# EAGLE design pc-bus (EAGLE 9.6.2)
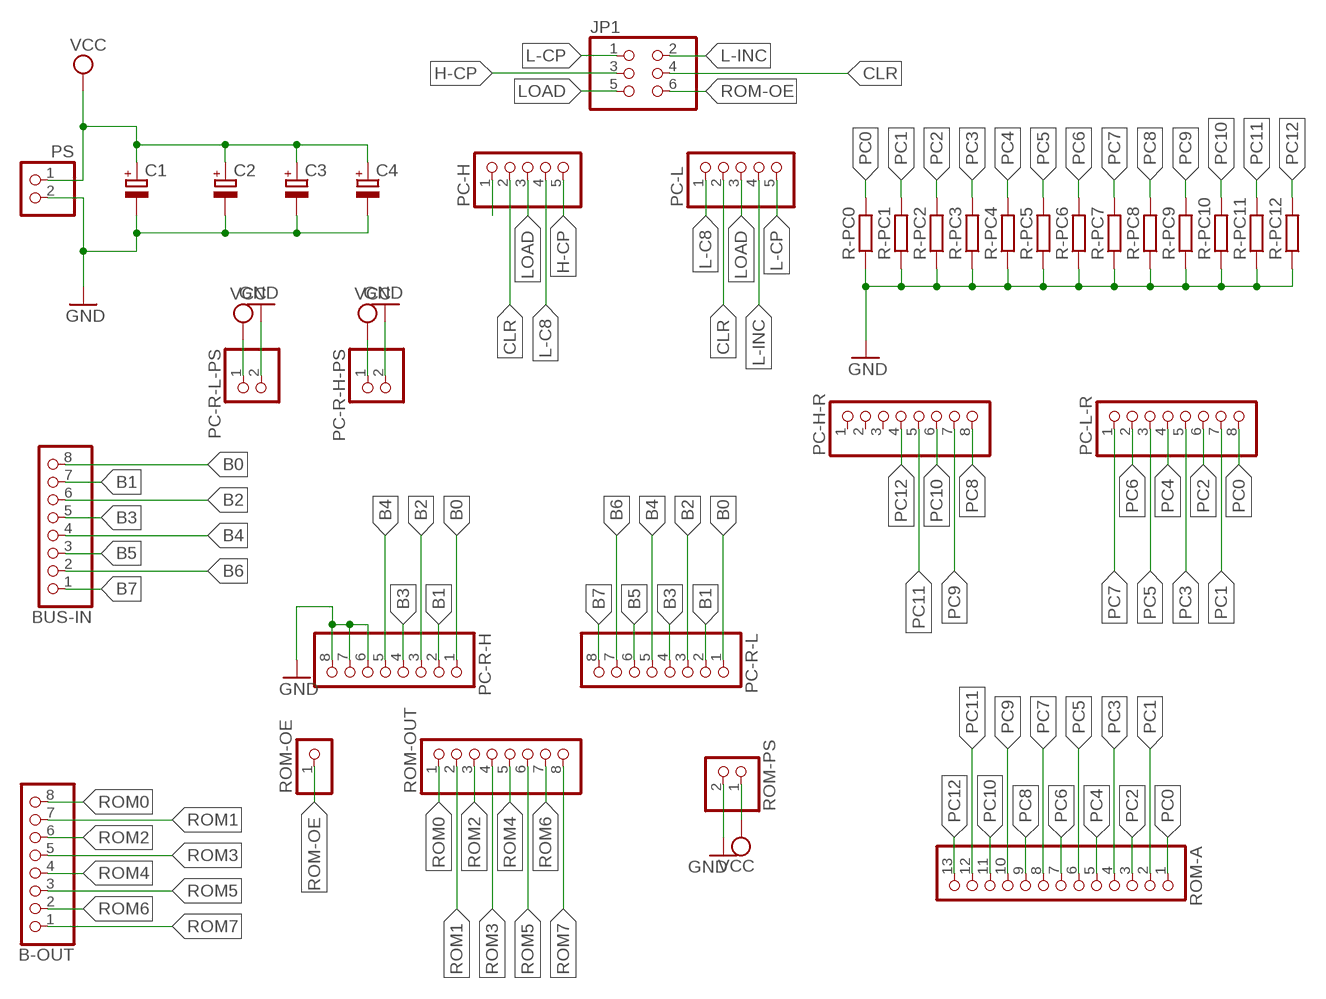
[diagram p0: schematic, sheet 1]

## Parts
B-OUT  PINHD-1X8  [1X08]
BUS-IN  PINHD-1X8  [1X08]
C1  CPOL-EUE3.5-8  [E3,5-8]
C2  CPOL-EUE3.5-8  [E3,5-8]
C3  CPOL-EUE3.5-8  [E3,5-8]
C4  CPOL-EUE3.5-8  [E3,5-8]
JP1  PINHD-2X3  [2X03]
PC-H  PINHD-1X5  [1X05]
PC-H-R  PINHD-1X8  [1X08]
PC-L  PINHD-1X5  [1X05]
PC-L-R  PINHD-1X8  [1X08]
PC-R-H  PINHD-1X8  [1X08]
PC-R-H-PS  PINHD-1X2  [1X02]
PC-R-L  PINHD-1X8  [1X08]
PC-R-L-PS  PINHD-1X2  [1X02]
PS  PINHD-1X2  [1X02]
R-PC0  R-EU_0204/7  [0204/7]
R-PC1  R-EU_0204/7  [0204/7]
R-PC2  R-EU_0204/7  [0204/7]
R-PC3  R-EU_0204/7  [0204/7]
R-PC4  R-EU_0204/7  [0204/7]
R-PC5  R-EU_0204/7  [0204/7]
R-PC6  R-EU_0204/7  [0204/7]
R-PC7  R-EU_0204/7  [0204/7]
R-PC8  R-EU_0204/7  [0204/7]
R-PC9  R-EU_0204/7  [0204/7]
R-PC10  R-EU_0204/7  [0204/7]
R-PC11  R-EU_0204/7  [0204/7]
R-PC12  R-EU_0204/7  [0204/7]
ROM-A  PINHD-1X13  [1X13]
ROM-OE  PINHD-1X1  [1X01]
ROM-OUT  PINHD-1X8  [1X08]
ROM-PS  PINHD-1X2  [1X02]

## Nets
B0: BUS-IN.8 PC-R-H.1 PC-R-L.1
B1: BUS-IN.7 PC-R-H.2 PC-R-L.2
B2: BUS-IN.6 PC-R-H.3 PC-R-L.3
B3: BUS-IN.5 PC-R-H.4 PC-R-L.4
B4: BUS-IN.4 PC-R-H.5 PC-R-L.5
B5: BUS-IN.3 PC-R-L.6
B6: BUS-IN.2 PC-R-L.7
B7: BUS-IN.1 PC-R-L.8
CLR: JP1.4 PC-H.2 PC-L.2
GND: C1.- C2.- C3.- C4.- PC-R-H-PS.2 PC-R-H.6 PC-R-H.7 PC-R-H.8 PC-R-L-PS.2 PS.2 R-PC0.1 R-PC1.1 R-PC2.1 R-PC3.1 R-PC4.1 R-PC5.1 R-PC6.1 R-PC7.1 R-PC8.1 R-PC9.1 R-PC10.1 R-PC11.1 R-PC12.1 ROM-PS.2
H-C8: PC-H.1
H-CP: JP1.3 PC-H.5
L-C8: PC-H.4 PC-L.1
L-CP: JP1.1 PC-L.5
L-INC: JP1.2 PC-L.4
LOAD: JP1.5 PC-H.3 PC-L.3
PC0: PC-L-R.8 R-PC0.2 ROM-A.1
PC1: PC-L-R.7 R-PC1.2 ROM-A.2
PC2: PC-L-R.6 R-PC2.2 ROM-A.3
PC3: PC-L-R.5 R-PC3.2 ROM-A.4
PC4: PC-L-R.4 R-PC4.2 ROM-A.5
PC5: PC-L-R.3 R-PC5.2 ROM-A.6
PC6: PC-L-R.2 R-PC6.2 ROM-A.7
PC7: PC-L-R.1 R-PC7.2 ROM-A.8
PC8: PC-H-R.8 R-PC8.2 ROM-A.9
PC9: PC-H-R.7 R-PC9.2 ROM-A.10
PC10: PC-H-R.6 R-PC10.2 ROM-A.11
PC11: PC-H-R.5 R-PC11.2 ROM-A.12
PC12: PC-H-R.4 R-PC12.2 ROM-A.13
ROM0: B-OUT.8 ROM-OUT.1
ROM1: B-OUT.7 ROM-OUT.2
ROM2: B-OUT.6 ROM-OUT.3
ROM3: B-OUT.5 ROM-OUT.4
ROM4: B-OUT.4 ROM-OUT.5
ROM5: B-OUT.3 ROM-OUT.6
ROM6: B-OUT.2 ROM-OUT.7
ROM7: B-OUT.1 ROM-OUT.8
ROM-OE: JP1.6 ROM-OE.1
VCC: C1.+ C2.+ C3.+ C4.+ PC-R-H-PS.1 PC-R-L-PS.1 PS.1 ROM-PS.1
Unconnected: PC-H-R.1 PC-H-R.2 PC-H-R.3

## Library data of the parts
B-OUT BUS-IN PC-H-R PC-L-R PC-R-H PC-R-L ROM-OUT = pinhead:PINHD-1X8: PIN HEADER
C1-C4 = rcl:CPOL-EU: POLARIZED CAPACITOR, European symbol; SPICEPREFIX: C
JP1 = pinhead:PINHD-2X3: PIN HEADER
PC-H PC-L = pinhead:PINHD-1X5: PIN HEADER
PC-R-H-PS PC-R-L-PS PS ROM-PS = pinhead:PINHD-1X2: PIN HEADER
R-PC0 R-PC1-R-PC12 = rcl:R-EU_: RESISTOR, European symbol; SPICEPREFIX: R
ROM-A = pinhead:PINHD-1X13: PIN HEADER
ROM-OE = pinhead:PINHD-1X1: PIN HEADER

## Board
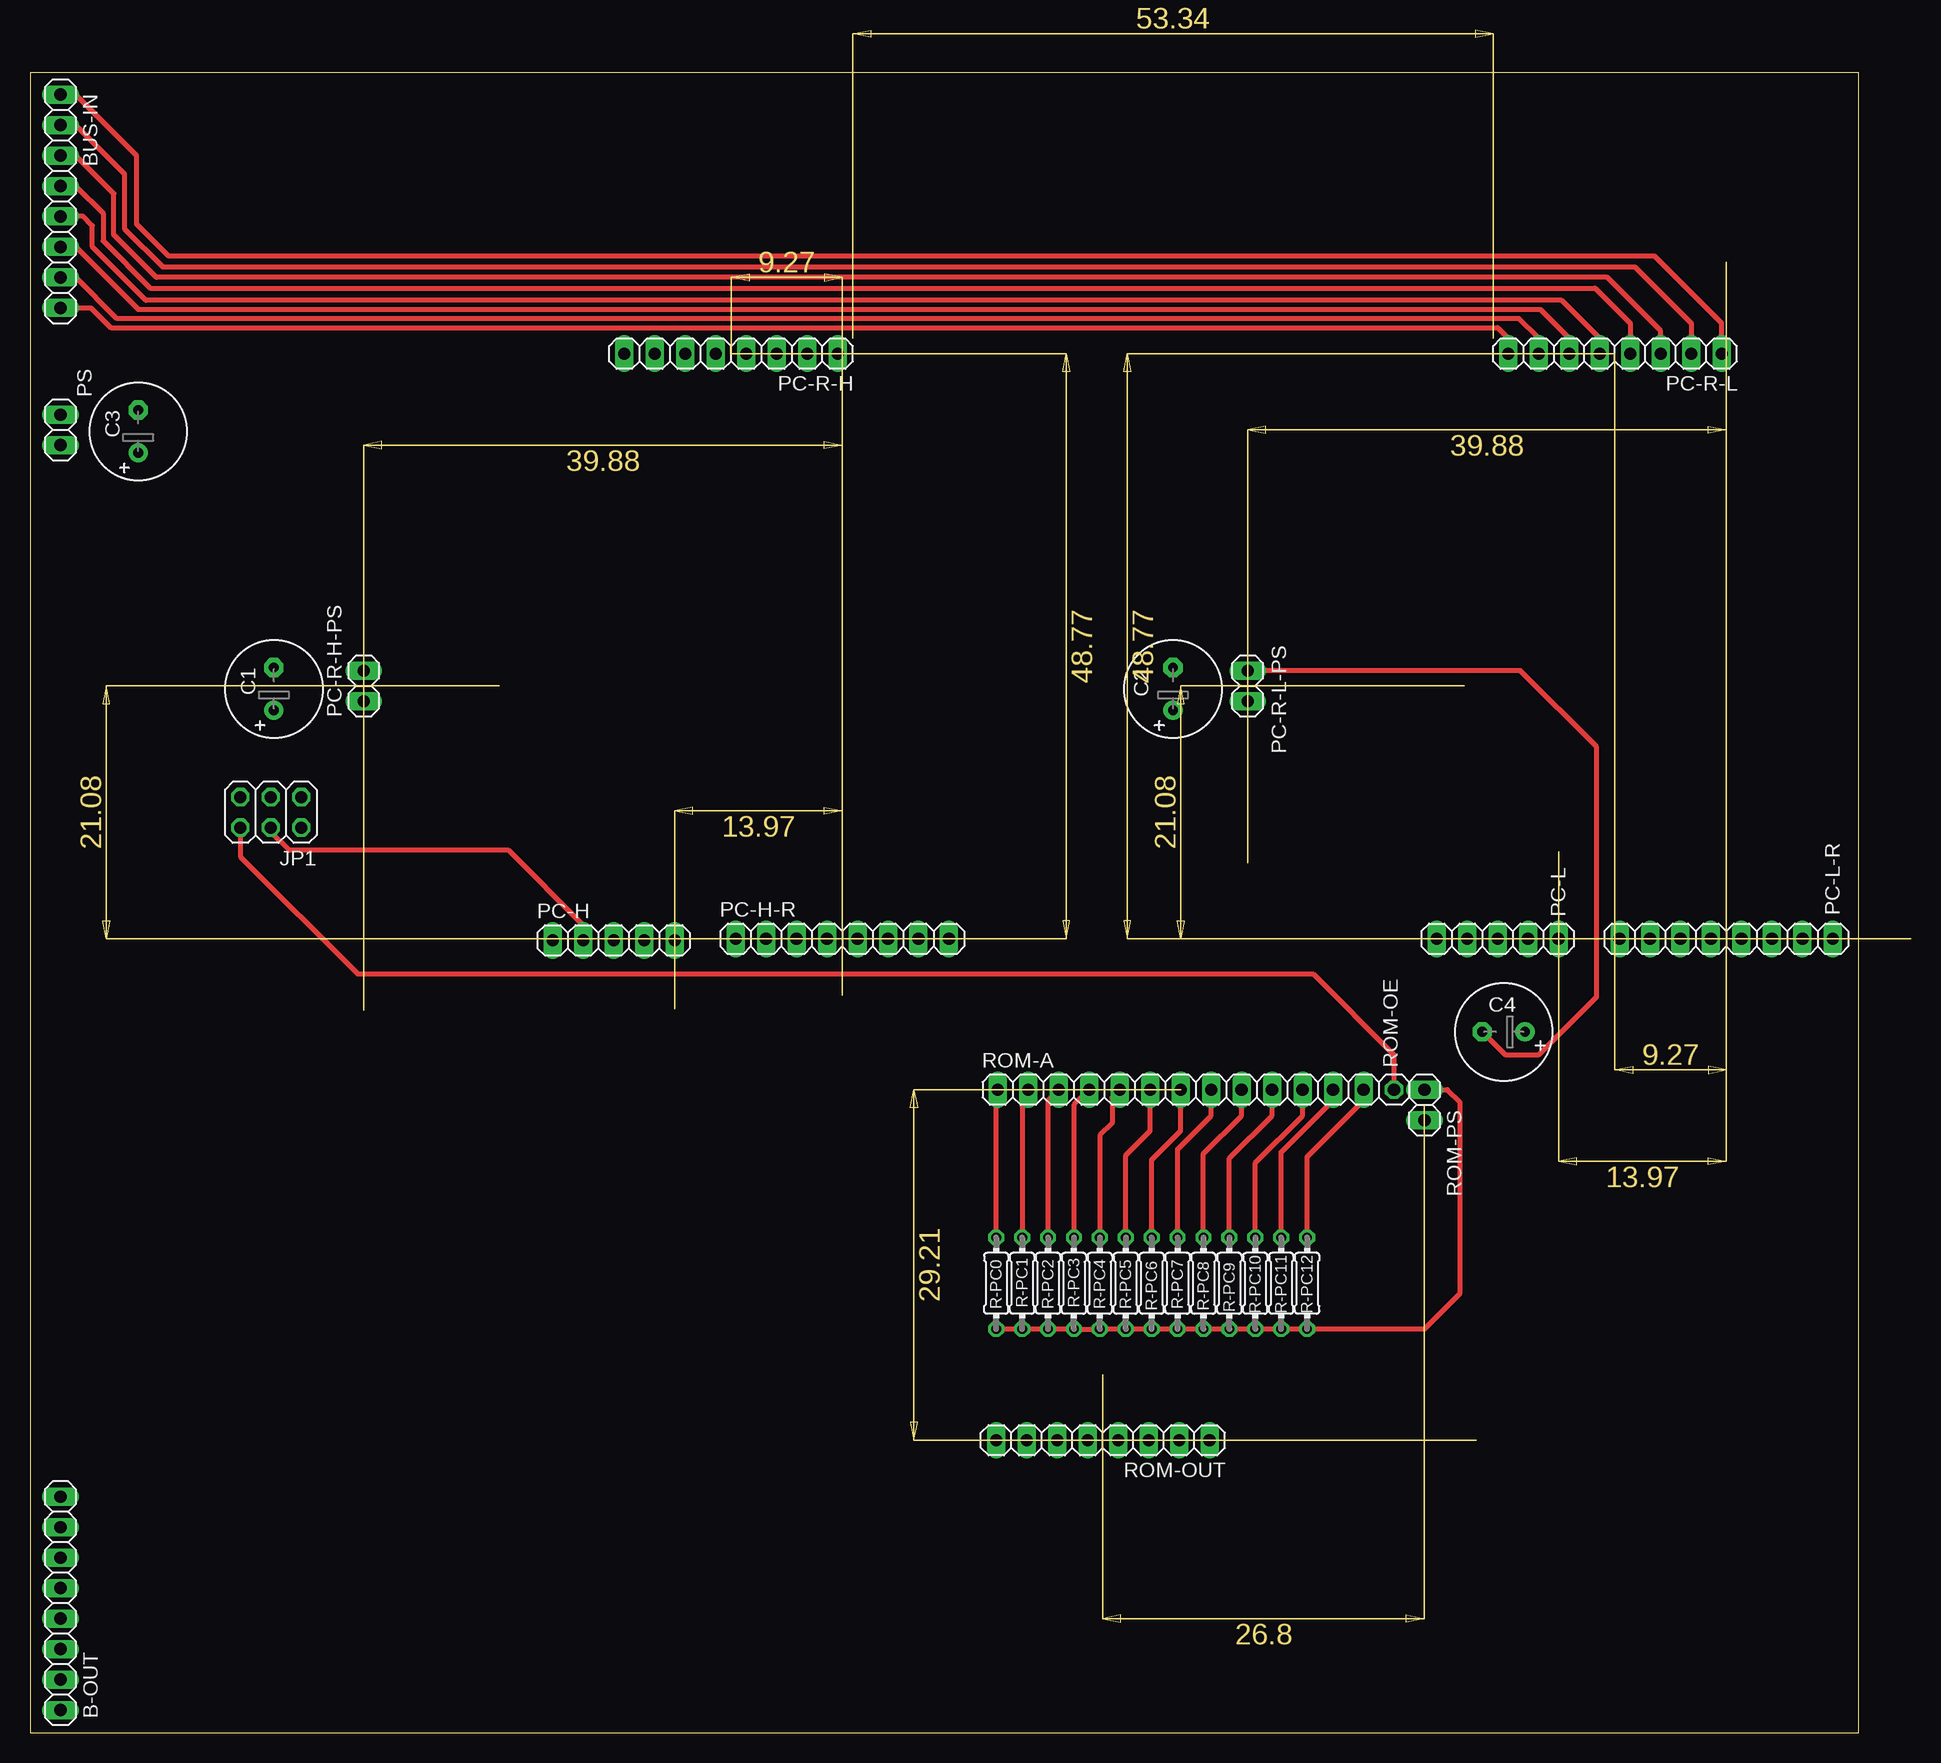
[diagram p1: board, top side]
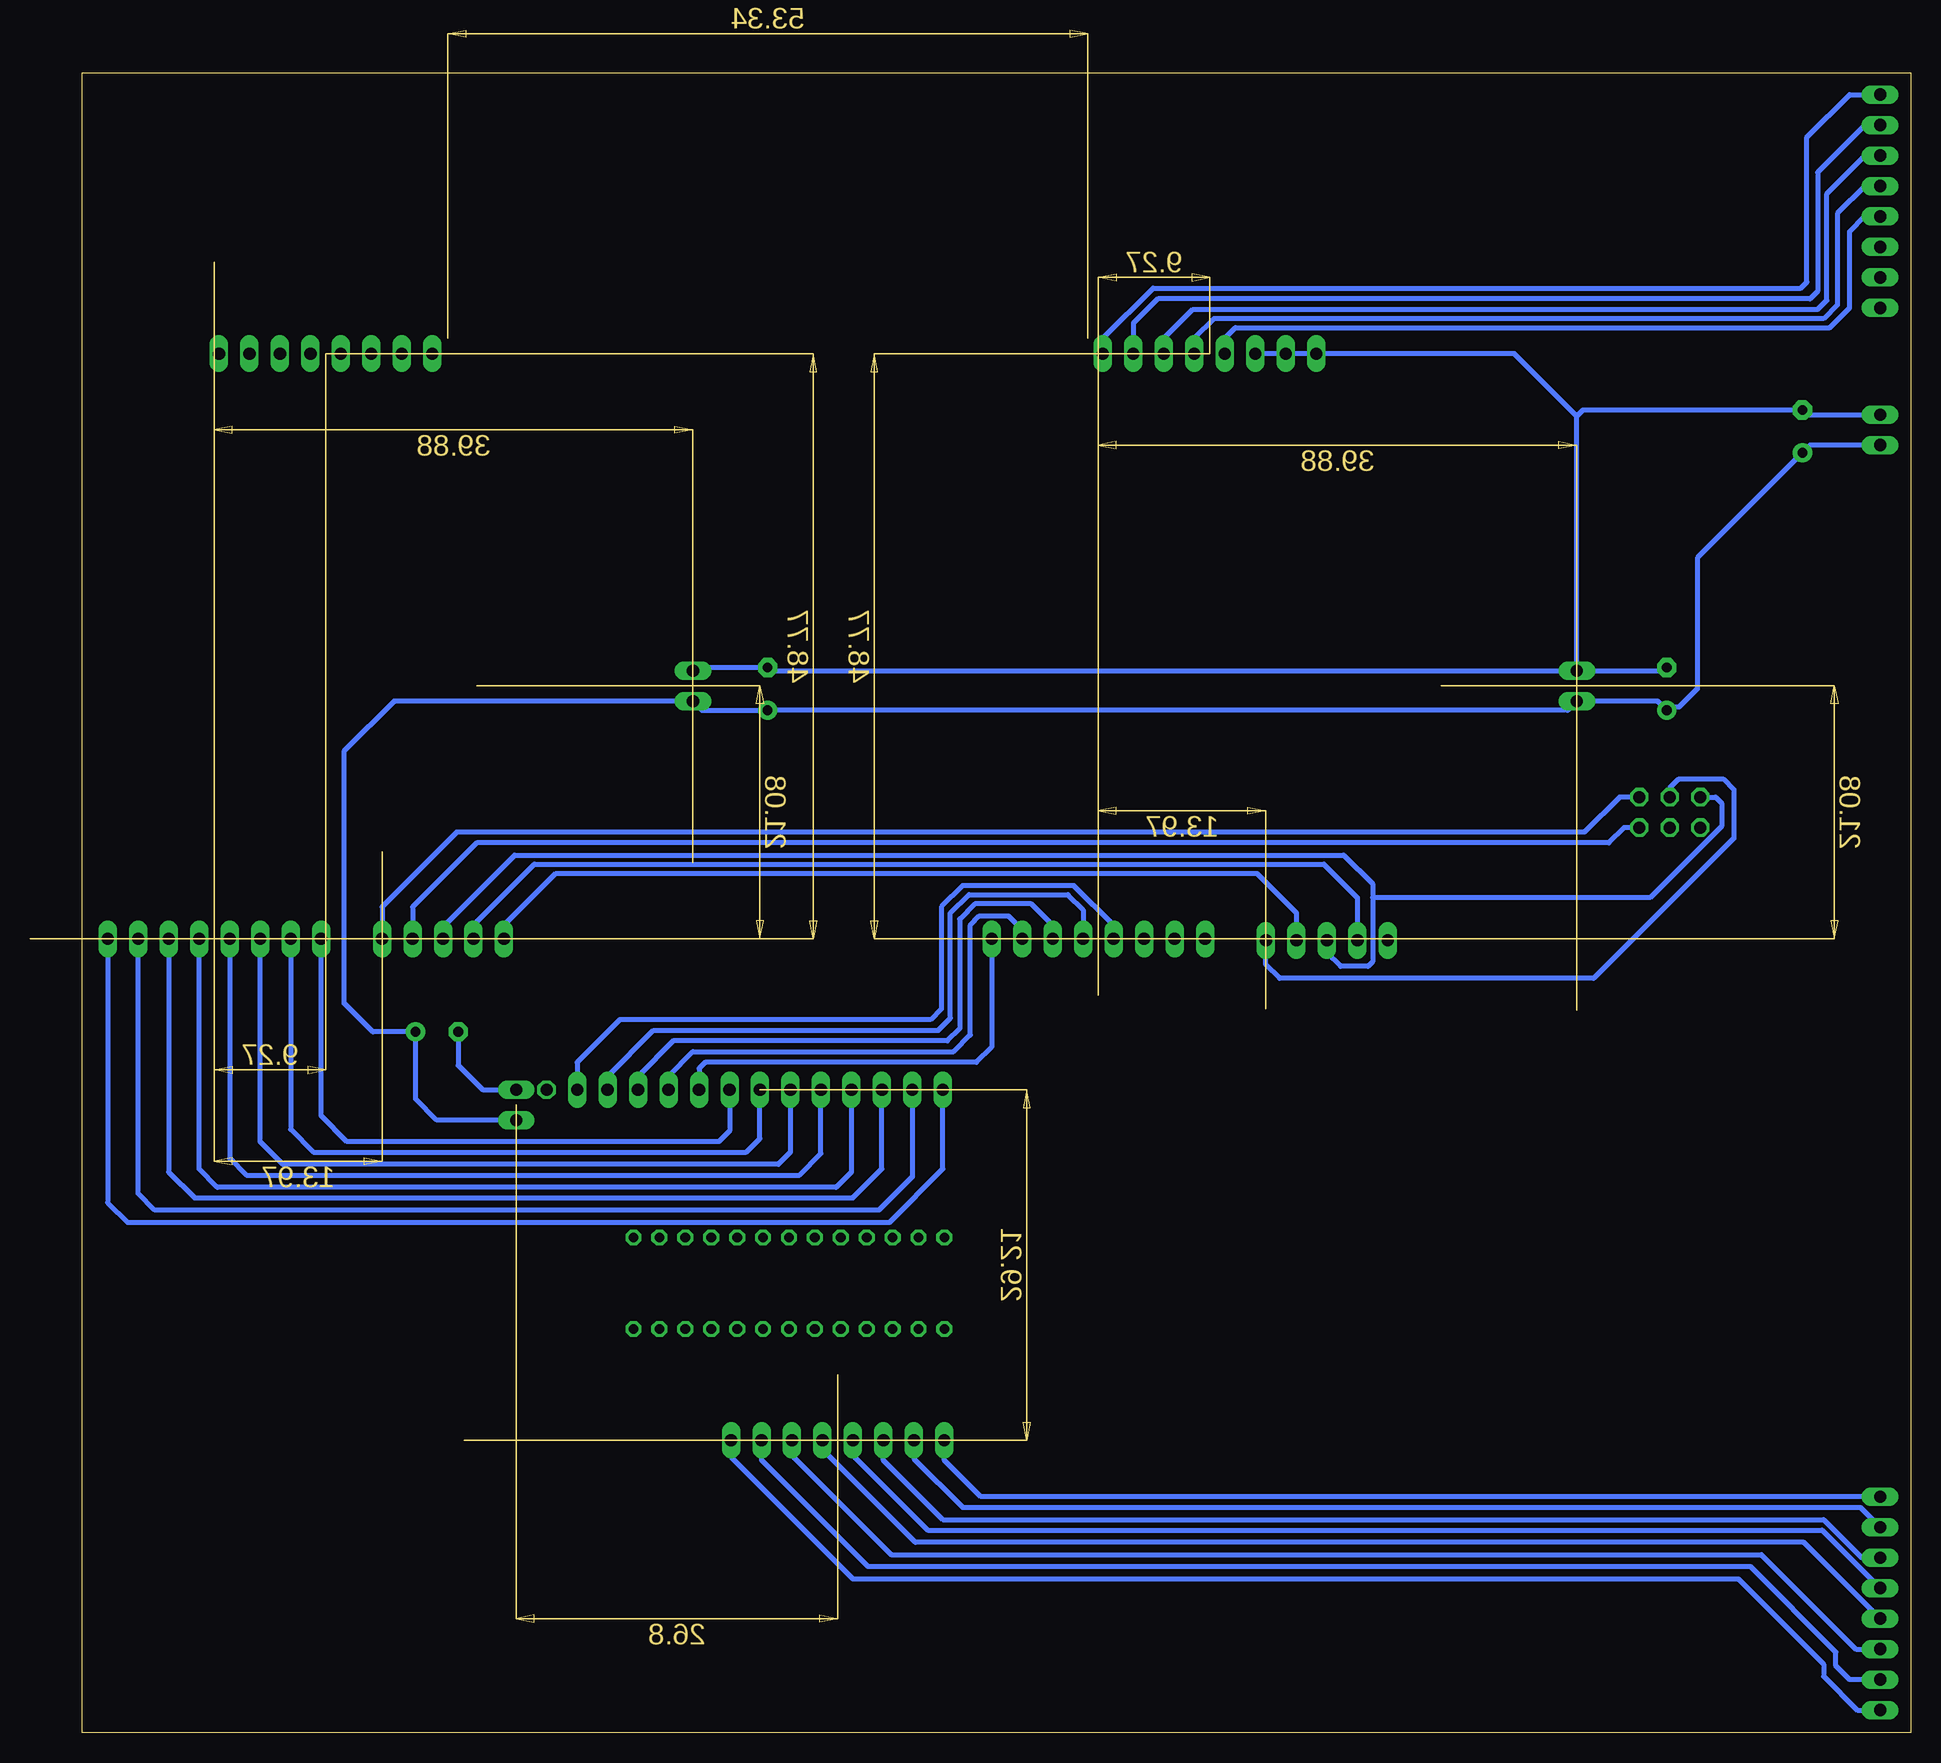
[diagram p2: board, bottom side, seen from below]

Size 152.38 x 138.35 mm. Coordinates in mm from the lower left corner, seen from the top.
Outline: 0,0 152.38,0 152.38,138.35 0,138.35 0,0
Copper layers (1*16): Top 0.035mm / dielectric 1.5mm / Bottom 0.035mm
Design rules "default": minimum track width 6mil, minimum drill 0.35mm, track to track 6mil, track to pad 6mil, pad to pad 6mil, via to via 6mil, smd to smd 6mil, copper to edge 40mil, drill to drill 6mil, minimum pad ring 10mil, minimum via ring 8mil, stop-mask expansion 4mil, vias tented up to drill 0mil, thermal gap 10mil

### Footprints (pad centres in the part's own frame; a part is rotated, then mirrored left to right if it is on the bottom)
1X08 = drill 1.016 long: 1 -8.89,0; 2 -6.35,0; 3 -3.81,0; 4 -1.27,0; 5 1.27,0; 6 3.81,0; 7 6.35,0; 8 8.89,0
E3,5-8 = drill 0.813 pad 1.6: + -1.778,0 | drill 0.813 pad 1.6 octagon: - 1.778,0
2X03 = drill 1.016 octagon: 1 -2.54,-1.27; 2 -2.54,1.27; 3 0,-1.27; 4 0,1.27; 5 2.54,-1.27; 6 2.54,1.27
1X05 = drill 1.016 long: 1 -5.08,0; 2 -2.54,0; 3 0,0; 4 2.54,0; 5 5.08,0
1X02 = drill 1.016 long: 1 -1.27,0; 2 1.27,0
0204/7 = drill 0.813 octagon: 1 -3.81,0; 2 3.81,0
1X13 = drill 1.016 long: 1 -15.24,0; 2 -12.7,0; 3 -10.16,0; 4 -7.62,0; 5 -5.08,0; 6 -2.54,0; 7 0,0; 8 2.54,0; 9 5.08,0; 10 7.62,0; 11 10.16,0; 12 12.7,0; 13 15.24,0
1X01 = drill 1.016 octagon: 1 0,0

### Placement (x,y rotation side)
B-OUT  2.54,10.79 270 top
BUS-IN  2.54,127.64 90 top
C1  20.32,87 90 top
C2  95.25,87 90 top
C3  9.02,108.46 90 top
C4  122.81,58.42 180 top
JP1  20.07,76.71 180 top
PC-H  48.64,66.04 0 top
PC-H-R  67.69,66.17 0 top
PC-L  122.3,66.17 0 top
PC-L-R  141.35,66.17 0 top
PC-R-H  58.42,114.94 180 top
PC-R-H-PS  27.81,87.25 90 top
PC-R-L  132.08,114.94 180 top
PC-R-L-PS  101.47,87.25 90 top
PS  2.54,108.58 90 top
R-PC0  80.52,37.47 90 top
R-PC1  82.68,37.47 90 top
R-PC2  84.84,37.47 90 top
R-PC3  87,37.47 90 top
R-PC4  89.15,37.47 90 top
R-PC5  91.31,37.47 90 top
R-PC6  93.47,37.47 90 top
R-PC7  95.63,37.47 90 top
R-PC8  97.79,37.47 90 top
R-PC9  99.95,37.47 90 top
R-PC10  102.11,37.47 90 top
R-PC11  104.27,37.47 90 top
R-PC12  106.43,37.47 90 top
ROM-A  95.89,53.59 0 top
ROM-OE  113.67,53.59 0 top
ROM-OUT  89.41,24.38 180 top
ROM-PS  116.2,52.32 90 top

### Tracks (layer width: path | path; a pad name or v marks a point on that pad's centre or on a via)
B0
  Top 0.4: BUS-IN.8 3.81,136.53 8.89,131.44 8.89,125.73 11.56,123.06 135.38,123.06 140.97,117.47 PC-R-L.1
  Bottom 0.4: PC-R-H.1 67.31,116.2 63.12,120.4 9.14,120.4 8.64,120.9 8.64,132.97 5.08,136.53 BUS-IN.8
B1
  Top 0.4: BUS-IN.7 3.81,133.99 7.87,129.92 7.87,125.35 11.05,122.17 133.73,122.17 138.43,117.47 PC-R-L.2
  Bottom 0.4: BUS-IN.7 3.81,133.99 7.75,130.05 7.75,120.14 8.38,119.51 62.74,119.51 64.77,117.47 PC-R-H.2
B2
  Top 0.4: BUS-IN.6 3.81,131.44 6.99,128.27 6.99,124.84 10.54,121.28 131.44,121.28 135.89,116.84 PC-R-L.3
  Bottom 0.4: PC-R-H.3 62.23,116.2 59.82,118.62 7.75,118.62 6.99,119.38 6.99,128.27 3.81,131.44 BUS-IN.6
B3
  Top 0.4: BUS-IN.5 3.81,128.91 6.1,126.62 6.1,124.33 10.03,120.4 130.43,120.4 133.35,117.47 PC-R-L.4
  Bottom 0.4: BUS-IN.5 3.81,128.91 6.1,126.62 6.1,119 7.24,117.86 58.04,117.86 59.69,116.2 PC-R-H.4
B4
  Top 0.4: PC-R-L.5 130.81,116.2 127.64,119.38 9.65,119.38 5.21,123.83 5.21,125.6 4.45,126.36 BUS-IN.4
  Bottom 0.4: PC-R-H.5 57.15,116.2 56.26,117.09 6.73,117.09 5.08,118.75 5.08,125.09 3.81,126.36 BUS-IN.4
B5
  Top 0.4: BUS-IN.3 3.81,123.83 9.02,118.62 125.86,118.62 128.27,116.2 PC-R-L.6
B6
  Top 0.4: PC-R-L.7 125.73,116.2 124.08,117.86 7.24,117.86 3.81,121.28 BUS-IN.2
B7
  Top 0.4: BUS-IN.1 5.08,118.75 6.73,117.09 122.3,117.09 123.19,116.2 PC-R-L.8
CLR
  Top 0.4: PC-H.2 46.1,67.31 39.88,73.53 21.59,73.53 20.07,75.06 JP1.4
  Bottom 0.4: PC-L.2 119.76,67.31 114.68,72.39 48.9,72.39 46.1,69.6 PC-H.2
GND
  Top 0.4: C4.- 122.94,56.52 125.73,56.52 130.56,61.34 130.56,82.17 124.21,88.52 PC-R-L-PS.2 | ROM-PS.2 118.11,53.59 119.13,52.58 119.13,36.58 116.2,33.66 R-PC12.1 R-PC11.1 R-PC10.1 R-PC9.1 R-PC8.1 R-PC7.1 R-PC6.1 R-PC5.1 R-PC4.1 R-PC3.1 R-PC2.1 R-PC1.1 R-PC0.1
  Bottom 0.4: C4.- 121.03,55.63 119,53.59 ROM-PS.2 | PC-R-L-PS.2 101.22,88.77 C2.- 95,88.52 PC-R-H-PS.2 | PC-R-H-PS.2 20.57,88.52 C1.- | PS.2 8.64,109.86 C3.- 27.3,110.24 27.81,109.73 | PC-R-H-PS.2 27.81,109.73 | 27.81,109.73 33.02,114.94 PC-R-H.8 PC-R-H.7 PC-R-H.6
H-CP
  Bottom 0.4: JP1.3 20.07,78.74 19.3,79.5 15.62,79.5 14.73,78.61 14.73,74.55 26.42,62.87 52.58,62.87 53.72,64.01 PC-H.5
L-C8
  Bottom 0.4: PC-L.1 117.22,67.31 112.9,71.63 54.48,71.63 51.18,68.33 PC-H.4
L-CP
  Bottom 0.4: JP1.1 24.26,77.98 27.18,75.06 121.16,75.06 127.38,68.83 PC-L.5
L-INC
  Bottom 0.4: JP1.2 23.88,75.44 25.15,74.17 119.51,74.17 124.84,68.83 PC-L.4
LOAD
  Bottom 0.4: PC-L.3 122.3,67.18 116.33,73.15 47.24,73.15 44.83,70.74 44.83,69.6 | PC-H.3 48.64,65.02 47.5,63.88 45.21,63.88 44.83,64.26 44.83,69.6 | JP1.5 16.26,77.98 15.75,77.47 15.75,75.56 21.72,69.6 44.83,69.6
PC0
  Top 0.4: R-PC0.2 80.52,53.47 ROM-A.1
  Bottom 0.4: PC-L-R.8 150.24,44.2 148.59,42.55 85.09,42.55 80.64,46.99 ROM-A.1
PC1
  Top 0.4: ROM-A.2 82.68,53.09 R-PC1.2
  Bottom 0.4: ROM-A.2 83.19,46.35 85.98,43.56 146.3,43.56 147.7,44.96 PC-L-R.7
PC2
  Top 0.4: R-PC2.2 84.84,52.7 ROM-A.3
  Bottom 0.4: PC-L-R.6 145.16,46.74 143,44.58 88.14,44.58 85.72,46.99 ROM-A.3
PC3
  Top 0.4: ROM-A.4 87,52.32 R-PC3.2
  Bottom 0.4: ROM-A.4 88.27,46.74 89.53,45.47 141.1,45.47 142.62,46.99 PC-L-R.5
PC4
  Top 0.4: ROM-A.5 90.17,52.96 90.17,50.8 89.15,49.78 R-PC4.2
  Bottom 0.4: PC-L-R.4 140.08,47.88 138.68,46.48 92.58,46.48 90.81,48.26 ROM-A.5
PC5
  Top 0.4: R-PC5.2 91.31,48.13 93.34,50.16 ROM-A.6
  Bottom 0.4: ROM-A.6 93.34,48.39 94.36,47.37 135.64,47.37 137.54,49.28 PC-L-R.3
PC6
  Top 0.4: R-PC6.2 93.47,47.75 95.89,50.16 ROM-A.7
  Bottom 0.4: PC-L-R.2 135,50.29 133.1,48.39 97.03,48.39 95.89,49.53 ROM-A.7
PC7
  Top 0.4: R-PC7.2 95.63,48.64 98.42,51.44 ROM-A.8
  Bottom 0.4: ROM-A.8 98.42,50.16 99.31,49.28 130.3,49.28 132.46,51.44 PC-L-R.1
PC8
  Top 0.4: R-PC8.2 97.79,48.26 100.97,51.44 ROM-A.9
  Bottom 0.4: PC-H-R.8 76.58,57.15 77.85,55.88 100.46,55.88 100.97,55.37 ROM-A.9
PC9
  Top 0.4: R-PC9.2 99.95,47.88 103.5,51.44 ROM-A.10
  Bottom 0.4: ROM-A.10 103.5,54.74 101.47,56.77 79.76,56.77 78.36,58.17 78.36,67.31 77.6,68.07 75.18,68.07 74.04,66.93 PC-H-R.7
PC10
  Top 0.4: R-PC10.2 102.11,47.5 106.05,51.44 ROM-A.11
  Bottom 0.4: PC-H-R.6 71.5,67.31 73.28,69.09 77.98,69.09 79.25,67.82 79.25,58.67 80.26,57.66 103.12,57.66 106.05,54.74 ROM-A.11
PC11
  Top 0.4: R-PC11.2 104.27,48.39 108.58,52.7 ROM-A.12
  Bottom 0.4: ROM-A.12 108.58,54.74 104.78,58.55 81.03,58.55 80.01,59.56 80.01,68.33 78.49,69.85 70.23,69.85 68.96,68.58 PC-H-R.5
PC12
  Top 0.4: R-PC12.2 106.43,48.01 111.12,52.7 ROM-A.13
  Bottom 0.4: PC-H-R.4 66.42,67.31 69.72,70.61 78.99,70.61 80.77,68.83 80.77,60.33 81.66,59.44 107.57,59.44 111.12,55.88 ROM-A.13
ROM0
  Bottom 0.4: ROM-OUT.1 98.3,22.99 88.14,12.83 14.35,12.83 7.24,5.71 7.24,4.7 4.45,1.91 B-OUT.8
ROM1
  Bottom 0.4: B-OUT.7 5.08,4.45 6.22,5.59 6.22,6.73 13.34,13.84 86.87,13.84 95.76,22.73 ROM-OUT.2
ROM2
  Bottom 0.4: ROM-OUT.3 93.22,23.11 84.96,14.86 12.45,14.86 4.57,6.99 B-OUT.6
ROM3
  Bottom 0.4: B-OUT.5 8.89,15.88 82.93,15.88 90.68,23.62 ROM-OUT.4
ROM4
  Bottom 0.4: ROM-OUT.5 88.14,23.11 81.92,16.89 7.37,16.89 B-OUT.4
ROM5
  Bottom 0.4: ROM-OUT.6 85.6,22.73 80.64,17.78 7.24,17.78 4.06,14.61 B-OUT.3
ROM6
  Bottom 0.4: ROM-OUT.7 83.06,22.86 78.99,18.8 4.19,18.8 B-OUT.2
ROM7
  Bottom 0.4: ROM-OUT.8 80.52,22.73 77.47,19.68 B-OUT.1
ROM-OE
  Top 0.4: JP1.6 17.53,73.03 27.3,63.25 106.93,63.25 113.67,56.52 ROM-OE.1
VCC
  Bottom 0.4: ROM-PS.1 122.81,51.05 124.59,52.83 C4.+ 128.14,58.42 130.56,60.83 130.56,81.79 126.36,85.98 PC-R-L-PS.1 100.71,85.22 C2.+ 28.57,85.22 PC-R-H-PS.1 21.08,85.98 20.57,85.47 | C1.+ 20.57,85.47 | PS.1 8.38,107.31 C3.+ 17.78,97.92 17.78,87 19.3,85.47 20.57,85.47